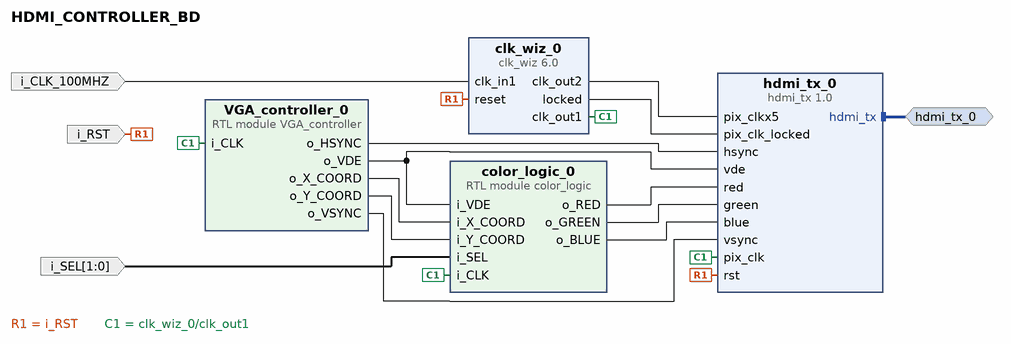
[diagram p0: block diagram of the top level]
# Vivado block design HDMI_CONTROLLER_BD, xc7z007sclg400-1, Vivado 2019.1
create_bd_design HDMI_CONTROLLER_BD

create_bd_intf_port -mode Master -vlnv xilinx.com:interface:hdmi_rtl:2.0 hdmi_tx_0
create_bd_port -dir I -type rst i_RST
set_property -dict {CONFIG.POLARITY ACTIVE_HIGH} [get_bd_ports i_RST]
create_bd_port -dir I -type clk i_CLK_100MHZ
set_property -dict {CONFIG.FREQ_HZ 100000000} [get_bd_ports i_CLK_100MHZ]
create_bd_port -dir I -from 1 -to 0 i_SEL

create_bd_cell -type ip -vlnv realdigital.org:realdigital:hdmi_tx:1.0 hdmi_tx_0
set_property -dict {CONFIG.MODE HDMI} [get_bd_cells hdmi_tx_0]
create_bd_cell -type module -reference color_logic color_logic_0
set_property -dict {CONFIG.v_HA_END 1280 CONFIG.v_VA_END 720} [get_bd_cells color_logic_0]
create_bd_cell -type ip -vlnv xilinx.com:ip:clk_wiz:6.0 clk_wiz_0
set_property -dict [list \
  CONFIG.CLKOUT1_JITTER 337.616 \
  CONFIG.CLKOUT1_PHASE_ERROR 322.999 \
  CONFIG.CLKOUT1_REQUESTED_OUT_FREQ 74.25 \
  CONFIG.CLKOUT2_JITTER 258.703 \
  CONFIG.CLKOUT2_PHASE_ERROR 322.999 \
  CONFIG.CLKOUT2_REQUESTED_OUT_FREQ 371.25 \
  CONFIG.CLKOUT2_USED true \
  CONFIG.MMCM_CLKFBOUT_MULT_F 37.125 \
  CONFIG.MMCM_CLKOUT0_DIVIDE_F 10.000 \
  CONFIG.MMCM_CLKOUT1_DIVIDE 2 \
  CONFIG.MMCM_DIVCLK_DIVIDE 5 \
  CONFIG.NUM_OUT_CLKS 2 \
] [get_bd_cells clk_wiz_0]
create_bd_cell -type module -reference VGA_controller VGA_controller_0

# ---- connections ----

connect_bd_intf_net [get_bd_intf_ports hdmi_tx_0] [get_bd_intf_pins hdmi_tx_0/hdmi_tx]
connect_bd_net -net reset_rtl_0_1 [get_bd_ports i_RST] [get_bd_pins hdmi_tx_0/rst] [get_bd_pins clk_wiz_0/reset]
connect_bd_net -net clk_100MHz_1 [get_bd_ports i_CLK_100MHZ] [get_bd_pins clk_wiz_0/clk_in1]
connect_bd_net [get_bd_pins clk_wiz_0/clk_out1] [get_bd_pins hdmi_tx_0/pix_clk] [get_bd_pins color_logic_0/i_CLK] [get_bd_pins VGA_controller_0/i_CLK]
connect_bd_net [get_bd_pins clk_wiz_0/clk_out2] [get_bd_pins hdmi_tx_0/pix_clkx5]
connect_bd_net [get_bd_pins clk_wiz_0/locked] [get_bd_pins hdmi_tx_0/pix_clk_locked]
connect_bd_net [get_bd_pins VGA_controller_0/o_HSYNC] [get_bd_pins hdmi_tx_0/hsync]
connect_bd_net [get_bd_pins VGA_controller_0/o_VSYNC] [get_bd_pins hdmi_tx_0/vsync]
connect_bd_net [get_bd_pins VGA_controller_0/o_VDE] [get_bd_pins hdmi_tx_0/vde] [get_bd_pins color_logic_0/i_VDE]
connect_bd_net [get_bd_pins color_logic_0/o_RED] [get_bd_pins hdmi_tx_0/red]
connect_bd_net [get_bd_pins color_logic_0/o_GREEN] [get_bd_pins hdmi_tx_0/green]
connect_bd_net [get_bd_pins color_logic_0/o_BLUE] [get_bd_pins hdmi_tx_0/blue]
connect_bd_net [get_bd_pins VGA_controller_0/o_X_COORD] [get_bd_pins color_logic_0/i_X_COORD]
connect_bd_net [get_bd_pins VGA_controller_0/o_Y_COORD] [get_bd_pins color_logic_0/i_Y_COORD]
connect_bd_net -net i_SEL_0_1 [get_bd_ports i_SEL] [get_bd_pins color_logic_0/i_SEL]

validate_bd_design
save_bd_design
